# Altium project STM32F446DEV.PrjPcb
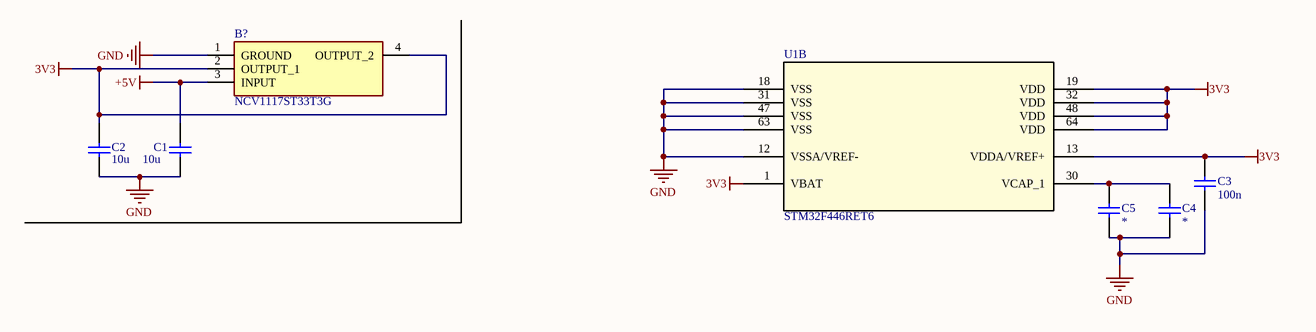
[diagram p0: Power.SchDoc]
3 sheets, 14 parts. Net scope: global (net labels, ports and power ports of the same name join across sheets).
Board file: STM32F446DEV.PcbDoc
Sheets:
  Power.SchDoc
  MCU.SchDoc
  Connector.SchDoc

## Sheet Power.SchDoc: STM32F446  Development Board
size A4; DrawnBy: EEE Patrick; Organization: PERT; Revision: A; SheetNumber: 1; SheetTotal: 3; Version: 1; Sub Team: EEE; Module: BMS; Generation: NA

### Parts
B?  NCV1117ST33T3G  [SOT230P700X180-4N]
C1  10u  [0603_SMD_C]
C2  10u  [0603_SMD_C]
C3  100n  [0603_SMD_RC]
C4  *  [0603_SMD_RC]
C5  *  [0603_SMD_RC]
U1  STM32F446RET6  [LQFP64-STM32F446]  (part B of 2)

### Nets
3V3: B?.2(OUTPUT_1) B?.4(OUTPUT_2) C2.2 C3.2 U1.1(VBAT) U1.13(VDDA/VREF+) U1.19(VDD) U1.32(VDD) U1.48(VDD) U1.64(VDD)
+5V: B?.3(INPUT) C1.2
GND: B?.1(GROUND) C1.1 C2.1 C3.1 C4.1 C5.1 U1.12(VSSA/VREF-) U1.18(VSS) U1.31(VSS) U1.47(VSS) U1.63(VSS)
NetC4_2: C4.2 C5.2 U1.30(VCAP_1)

### Notes on the sheet
- Title
- Generation
- Organization
- Sub Team
- Module
- Ver.
- Rev.
- Date
- Drawn By

### Library data of the parts
B? = NCV1117ST33T3G: ON SEMICONDUCTOR - NCV1117ST33T3G - Fixed LDO Voltage Regulator, 20V in, 1.07V Dropout, 3.3V/1A out, SOT-223-3; Manufacturer_Name: onsemi; Geometry.Height: 1.8mm; Mouser Part Number: 863-NCV1117ST33T3G; Mouser Price/Stock: https://www.mouser.co.uk/ProductDetail/onsemi/NCV1117ST33T3G?qs=8sOby8ZxZLHgqg5CFzeqiA%3D%3D; Manufacturer_Part_Number: NCV1117ST33T3G; Datasheet Link: http://www.onsemi.com/pub/Collateral/NCP1117-D.PDF
C1 C2 = 0603_SMD_Capacitor: 0603 SMD Capacitor; Value: 10u; Voltage Rating: *; Tolerance: *; Dielectric: *
C3-C5 = SMD 0603 Capacitor
  C3: Value: 100n
  C4 C5: Value: *
U1 = STM32F446RET6: No Description Available; Mfr_Name: STMicroelectronics; Copyright: Copyright (C) 2023 Ultra Librarian. All rights reserved.; Manufacturer_Part_Number: STM32F446RET6; RefDes: RefDes; Type: DEV

## Sheet MCU.SchDoc: STM32F446 Development Board
size A4; DrawnBy: EEE Patrcik; Organization: PERT; Revision: A; SheetNumber: 2; SheetTotal: 3; Version: 1; Sub Team: EEE; Module: BMS; Generation: NA
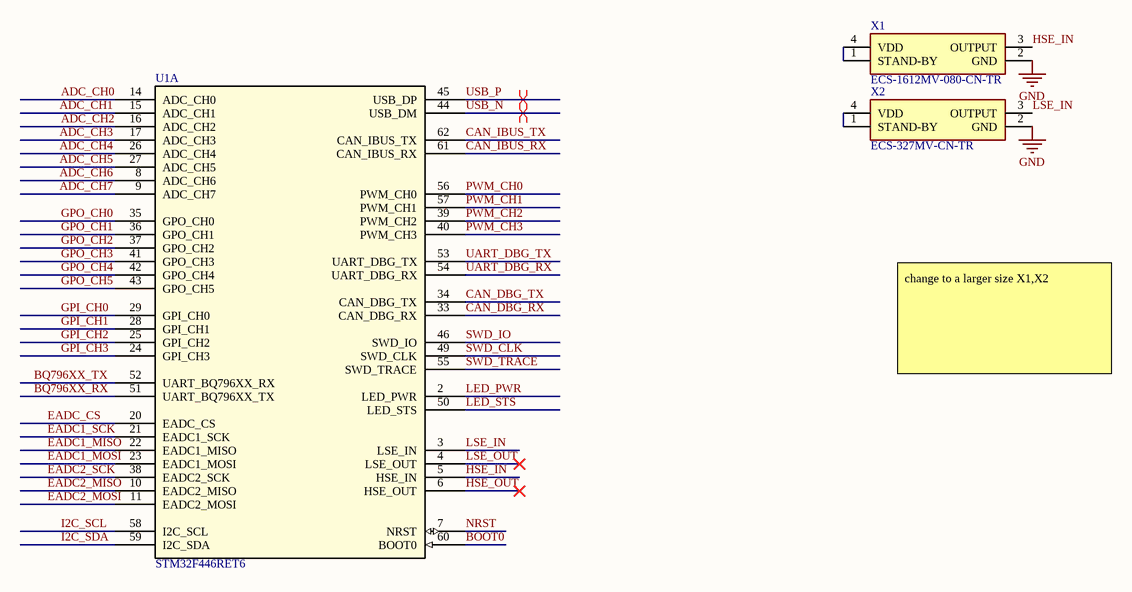
[diagram p1: MCU.SchDoc]

### Parts
U1  STM32F446RET6  [LQFP64-STM32F446]  (part A of 2)
X1  ECS-1612MV-080-CN-TR  [1612_OSXO_80]
X2  ECS-327MV-CN-TR  [1612_OSXO_32.768]

### Nets
GND: X1.2(GND) X2.2(GND)
ADC_CH0: U1.14(ADC_CH0)
ADC_CH1: U1.15(ADC_CH1)
ADC_CH2: U1.16(ADC_CH2)
ADC_CH3: U1.17(ADC_CH3)
ADC_CH4: U1.26(ADC_CH4)
ADC_CH5: U1.27(ADC_CH5)
ADC_CH6: U1.8(ADC_CH6)
ADC_CH7: U1.9(ADC_CH7)
BOOT0: U1.60(BOOT0)
BQ796XX_RX: U1.51(UART_BQ796XX_TX)
BQ796XX_TX: U1.52(UART_BQ796XX_RX)
CAN_DBG_RX: U1.33(CAN_DBG_RX)
CAN_DBG_TX: U1.34(CAN_DBG_TX)
CAN_IBUS_RX: U1.61(CAN_IBUS_RX)
CAN_IBUS_TX: U1.62(CAN_IBUS_TX)
EADC1_MISO: U1.22(EADC1_MISO)
EADC1_MOSI: U1.23(EADC1_MOSI)
EADC1_SCK: U1.21(EADC1_SCK)
EADC2_MISO: U1.10(EADC2_MISO)
EADC2_MOSI: U1.11(EADC2_MOSI)
EADC2_SCK: U1.38(EADC2_SCK)
EADC_CS: U1.20(EADC_CS)
GPI_CH0: U1.29(GPI_CH0)
GPI_CH1: U1.28(GPI_CH1)
GPI_CH2: U1.25(GPI_CH2)
GPI_CH3: U1.24(GPI_CH3)
GPO_CH0: U1.35(GPO_CH0)
GPO_CH1: U1.36(GPO_CH1)
GPO_CH2: U1.37(GPO_CH2)
GPO_CH3: U1.41(GPO_CH3)
GPO_CH4: U1.42(GPO_CH4)
GPO_CH5: U1.43(GPO_CH5)
HSE_IN: U1.5(HSE_IN) X1.3(OUTPUT)
HSE_OUT: U1.6(HSE_OUT)
I2C_SCL: U1.58(I2C_SCL)
I2C_SDA: U1.59(I2C_SDA)
LED_PWR: U1.2(LED_PWR)
LED_STS: U1.50(LED_STS)
LSE_IN: U1.3(LSE_IN) X2.3(OUTPUT)
LSE_OUT: U1.4(LSE_OUT)
NRST: U1.7(NRST)
PWM_CH0: U1.56(PWM_CH0)
PWM_CH1: U1.57(PWM_CH1)
PWM_CH2: U1.39(PWM_CH2)
PWM_CH3: U1.40(PWM_CH3)
SWD_CLK: U1.49(SWD_CLK)
SWD_IO: U1.46(SWD_IO)
SWD_TRACE: U1.55(SWD_TRACE)
UART_DBG_RX: U1.54(UART_DBG_RX)
UART_DBG_TX: U1.53(UART_DBG_TX)
USB_N: U1.44(USB_DM)
USB_P: U1.45(USB_DP)
NetX1_1: X1.1(STAND-BY) X1.4(VDD)
NetX2_1: X2.1(STAND-BY) X2.4(VDD)

### Layout directives
differential pair: USB_N, USB_P

### Notes on the sheet
- change to a larger size X1,X2
- Title
- Generation
- Organization
- Sub Team
- Module
- Ver.
- Rev.
- Date
- Drawn By

### Library data of the parts
U1 = STM32F446RET6: as U1 on sheet Power; Copyright: Copyright (C) 2023 Ultra Librarian. All rights reserved.; Manufacturer_Part_Number: STM32F446RET6; RefDes: RefDes; Type: DEV
X1 = 8M OSXO ECS: Standard Clock Oscillators 8MHz CMOS 1.6-3.6V; Manufacturer_Name: ECS; Geometry.Height: 0.7mm; Mouser Part Number: 520-1612MV-080-CNT; Mouser Price/Stock: https://www.mouser.co.uk/ProductDetail/ECS/ECS-1612MV-080-CN-TR?qs=MLItCLRbWswg5aTynjLSEQ%3D%3D; Manufacturer_Part_Number: ECS-1612MV-080-CN-TR; Datasheet Link: https://www.arrow.com/en/products/ecs-1612mv-080-cn-tr/ecs-international
X2 = 32.768k OSXO ECS: Standard Clock Oscillators 32.768kHz LVCMOS 1.6-3.6V; Manufacturer_Name: ECS; Geometry.Height: 0.7mm; Mouser Part Number: 520-327MV-CNT; Mouser Price/Stock: https://www.mouser.co.uk/ProductDetail/ECS/ECS-327MV-CN-TR?qs=MLItCLRbWswJ3OzWTZUbfw%3D%3D; Manufacturer_Part_Number: ECS-327MV-CN-TR; Datasheet Link: https://datasheet.datasheetarchive.com/originals/dk/DKDS42/DSANUWW0043417.pdf

## Sheet Connector.SchDoc
size A4; Organization: PERT; SheetNumber: 3; SheetTotal: 3; Sub Team: EEE
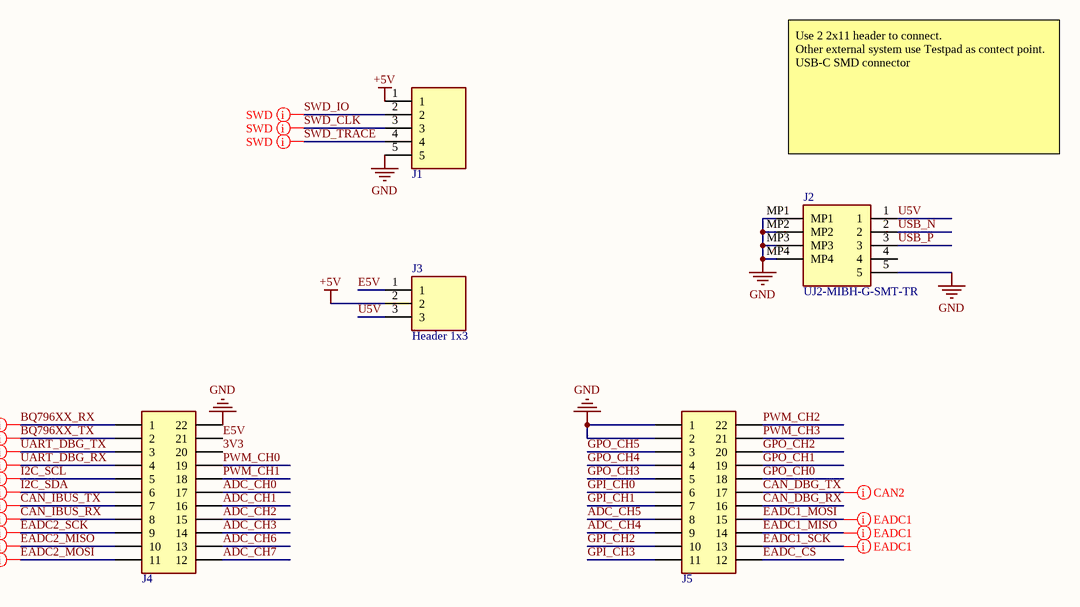
[diagram p2: Connector.SchDoc]

### Parts
J1  Header 1x5  [HDR_1X5_2.54_SMD]  (value not drawn)
J2  UJ2-MIBH-G-SMT-TR  [USB_B_5P_SMD]
J3  Header 1x3  [HDR_1X3_2.54_THD]
J4  Header 1x5  [HDR_2x11_2.54_THD]  (value not drawn)
J5  Header 1x5  [HDR_2x11_2.54_THD]  (value not drawn)

### Nets
3V3: J4.20
+5V: J1.1 J3.2
GND: J1.5 J2.5 J2.MP1 J2.MP2 J2.MP3 J2.MP4 J4.22 J5.1 J5.2
ADC_CH0: J4.17
ADC_CH1: J4.16
ADC_CH2: J4.15
ADC_CH3: J4.14
ADC_CH4: J5.9
ADC_CH5: J5.8
ADC_CH6: J4.13
ADC_CH7: J4.12
BQ796XX_RX: J4.1
BQ796XX_TX: J4.2
CAN_DBG_RX: J5.16
CAN_DBG_TX: J5.17
CAN_IBUS_RX: J4.8
CAN_IBUS_TX: J4.7
E5V: J3.1 J4.21
EADC1_MISO: J5.14
EADC1_MOSI: J5.15
EADC1_SCK: J5.13
EADC2_MISO: J4.10
EADC2_MOSI: J4.11
EADC2_SCK: J4.9
EADC_CS: J5.12
GPI_CH0: J5.6
GPI_CH1: J5.7
GPI_CH2: J5.10
GPI_CH3: J5.11
GPO_CH0: J5.18
GPO_CH1: J5.19
GPO_CH2: J5.20
GPO_CH3: J5.5
GPO_CH4: J5.4
GPO_CH5: J5.3
I2C_SCL: J4.5
I2C_SDA: J4.6
PWM_CH0: J4.19
PWM_CH1: J4.18
PWM_CH2: J5.22
PWM_CH3: J5.21
SWD_CLK: J1.3
SWD_IO: J1.2
SWD_TRACE: J1.4
U5V: J2.1 J3.3
UART_DBG_RX: J4.4
UART_DBG_TX: J4.3
USB_N: J2.2
USB_P: J2.3

Not connected (* = marked no-connect by the designer): J2 4

### Layout directives
net class UART2; rule Matched Net Lengths [Tolerance = 1mm]: UART_DBG_RX, UART_DBG_TX
net class UART1; rule Matched Net Lengths [Tolerance = 1mm]: BQ796XX_RX, BQ796XX_TX
net class I2C; rule Matched Net Lengths [Tolerance = 1mm]: I2C_SCL, I2C_SDA
net class SWD; rule Matched Net Lengths [Tolerance = 1mm]: SWD_CLK, SWD_IO, SWD_TRACE
net class EADC1; rule Matched Net Lengths [Tolerance = 1mm]: EADC1_MISO, EADC1_MOSI, EADC1_SCK
net class EADC2; rule Matched Net Lengths [Tolerance = 1mm]: EADC2_MISO, EADC2_MOSI, EADC2_SCK
net class CAN1; rule Differential Pairs Routing [Pref Gap = 0.254mm    Min Gap  = 0.127mm    Max Gap  = 0.254mmPref Width = 0.254mm    Min Width  = 0.127mm    Max Width  = 0.381mm]; rule Matched Net Lengths [Tolerance = 1mm]: CAN_IBUS_RX, CAN_IBUS_TX
net class CAN2; rule Differential Pairs Routing [Pref Gap = 0.254mm    Min Gap  = 0.127mm    Max Gap  = 0.254mmPref Width = 0.254mm    Min Width  = 0.127mm    Max Width  = 0.381mm]; rule Matched Net Lengths [Tolerance = 1mm]: CAN_DBG_TX

### Notes on the sheet
- Use 2 2x11 header to connect.
  Other external system use Testpad as contect point.
  USB-C SMD connector
- Title
- Generation
- Organization
- Sub Team
- Module
- Ver.
- Rev.
- Date
- Drawn By

### Library data of the parts
J1 = Header 1x5: Manufacturer_Name: TE Connectivity; Manufacturer_Part_Number: 87224-5; Geometry.Height: 10.745mm; Datasheet Link: https://www.arrow.com/en/products/87224-5/te-connectivity
J2 = USB_B 5P: USB Connectors USB jack, 2.0, micro B type, 5 pin, horizontal, gold flash, SMT, TR; Manufacturer_Name: CUI Devices; Geometry.Height: 3.15mm; Mouser Part Number: 490-UJ2-MIBH-G-SMTTR; Mouser Price/Stock: https://www.mouser.co.uk/ProductDetail/CUI-Devices/UJ2-MIBH-G-SMT-TR?qs=IS%252B4QmGtzzpvS1XQusp0iA%3D%3D; Manufacturer_Part_Number: UJ2-MIBH-G-SMT-TR; Datasheet Link: cuidevices.com/product/resource/uj2-mibh-g-smt-tr.pdf
J3 = Header 1x3: Pin Header 2.54mm Pitch STR DIP, 1x3Pin, G/F, LCP, 8.08mm*2.54mm*3.18mm, Color-Black, Bag; Manufacturer_Name: Amphenol Communications Solutions; Manufacturer_Part_Number: G800LR305018EU; Geometry.Height: 10.82mm; Mouser Part Number: 523-G800LR305018EU; Mouser Price/Stock: https://www.mouser.co.uk/ProductDetail/Amphenol-Commercial-Products/G800LR305018EU?qs=PzGy0jfpSMsZaVkTJmYyRA%3D%3D; Datasheet Link: https://cdn.amphenol-cs.com/media/wysiwyg/files/drawing/g800lrxxxxxxeu_1.pdf
J4 J5 = Header 2x11: Geometry.Height: 10.745mm

## Nets that join several sheets
3V3: Power (10 pins), Connector (J4.20)
+5V: Power (B?.3 C1.2), Connector (J1.1 J3.2)
GND: Power (11 pins), MCU (X1.2 X2.2), Connector (9 pins)
ADC_CH0: MCU (U1.14), Connector (J4.17)
ADC_CH1: MCU (U1.15), Connector (J4.16)
ADC_CH2: MCU (U1.16), Connector (J4.15)
ADC_CH3: MCU (U1.17), Connector (J4.14)
ADC_CH4: MCU (U1.26), Connector (J5.9)
ADC_CH5: MCU (U1.27), Connector (J5.8)
ADC_CH6: MCU (U1.8), Connector (J4.13)
ADC_CH7: MCU (U1.9), Connector (J4.12)
BQ796XX_RX: MCU (U1.51), Connector (J4.1)
BQ796XX_TX: MCU (U1.52), Connector (J4.2)
CAN_DBG_RX: MCU (U1.33), Connector (J5.16)
CAN_DBG_TX: MCU (U1.34), Connector (J5.17)
CAN_IBUS_RX: MCU (U1.61), Connector (J4.8)
CAN_IBUS_TX: MCU (U1.62), Connector (J4.7)
EADC1_MISO: MCU (U1.22), Connector (J5.14)
EADC1_MOSI: MCU (U1.23), Connector (J5.15)
EADC1_SCK: MCU (U1.21), Connector (J5.13)
EADC2_MISO: MCU (U1.10), Connector (J4.10)
EADC2_MOSI: MCU (U1.11), Connector (J4.11)
EADC2_SCK: MCU (U1.38), Connector (J4.9)
EADC_CS: MCU (U1.20), Connector (J5.12)
GPI_CH0: MCU (U1.29), Connector (J5.6)
GPI_CH1: MCU (U1.28), Connector (J5.7)
GPI_CH2: MCU (U1.25), Connector (J5.10)
GPI_CH3: MCU (U1.24), Connector (J5.11)
GPO_CH0: MCU (U1.35), Connector (J5.18)
GPO_CH1: MCU (U1.36), Connector (J5.19)
GPO_CH2: MCU (U1.37), Connector (J5.20)
GPO_CH3: MCU (U1.41), Connector (J5.5)
GPO_CH4: MCU (U1.42), Connector (J5.4)
GPO_CH5: MCU (U1.43), Connector (J5.3)
I2C_SCL: MCU (U1.58), Connector (J4.5)
I2C_SDA: MCU (U1.59), Connector (J4.6)
PWM_CH0: MCU (U1.56), Connector (J4.19)
PWM_CH1: MCU (U1.57), Connector (J4.18)
PWM_CH2: MCU (U1.39), Connector (J5.22)
PWM_CH3: MCU (U1.40), Connector (J5.21)
SWD_CLK: MCU (U1.49), Connector (J1.3)
SWD_IO: MCU (U1.46), Connector (J1.2)
SWD_TRACE: MCU (U1.55), Connector (J1.4)
UART_DBG_RX: MCU (U1.54), Connector (J4.4)
UART_DBG_TX: MCU (U1.53), Connector (J4.3)
USB_N: MCU (U1.44), Connector (J2.2)
USB_P: MCU (U1.45), Connector (J2.3)